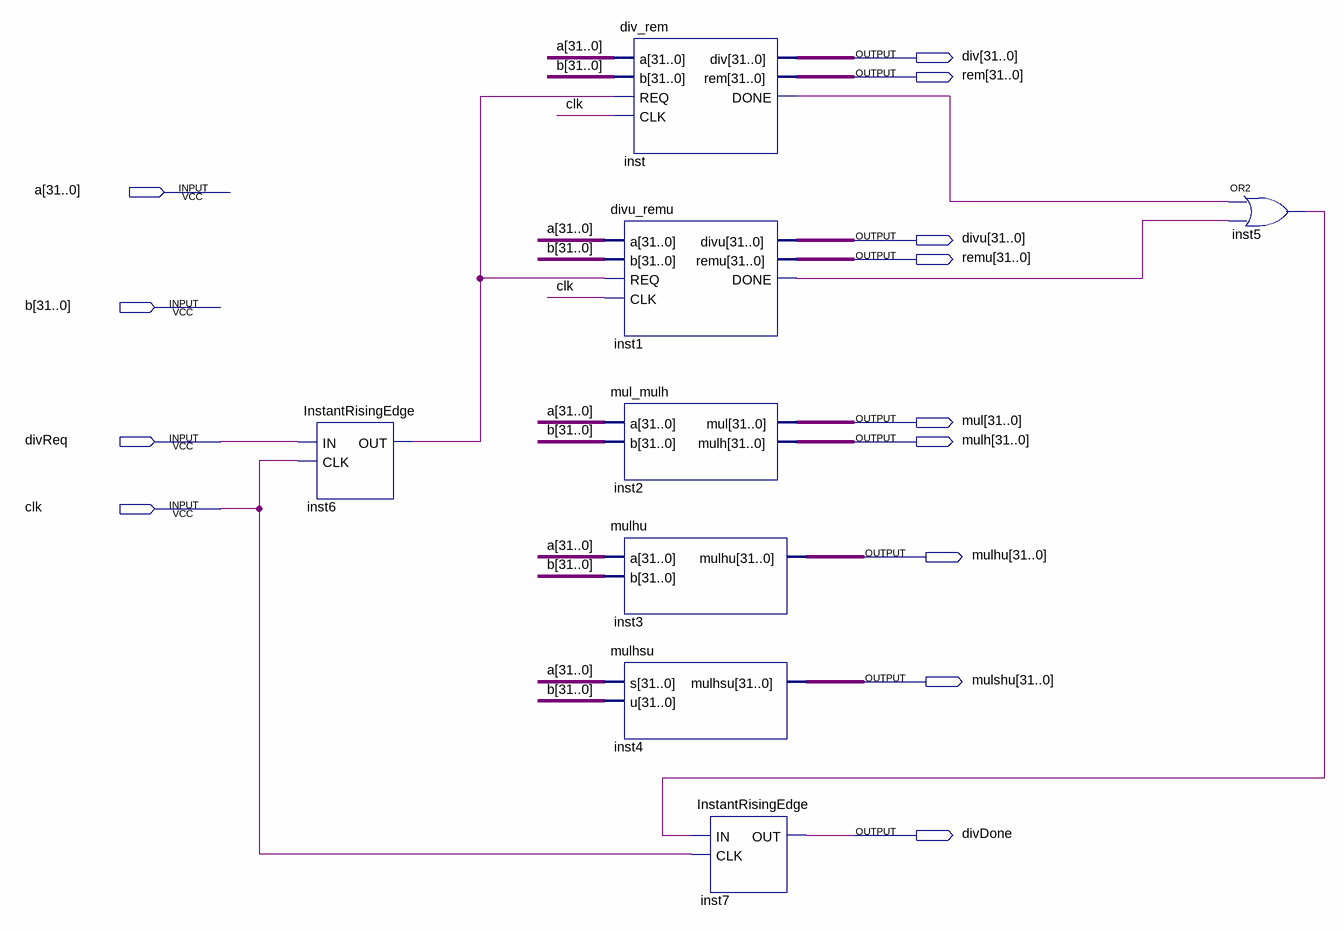
[diagram p0: schematic sheet]
// Quartus schematic mul.bdf as structural Verilog: 8 symbols, 13 pins
module mul (
  input  [31:0] a,
  input  [31:0] b,
  input  divReq,
  input  clk,
  output [31:0] div,
  output [31:0] rem,
  output [31:0] divu,
  output [31:0] remu,
  output [31:0] mul,
  output [31:0] mulh,
  output [31:0] mulhu,
  output [31:0] mulshu,
  output divDone
);

  wire inst1_done, inst5_out, inst6_out, inst_done;

  InstantRisingEdge inst6 (.IN(divReq), .CLK(clk), .OUT(inst6_out));
  div_rem inst (.a(a), .b(b), .REQ(inst6_out), .CLK(clk), .div(div), .rem(rem), .DONE(inst_done));
  divu_remu inst1 (.a(a), .b(b), .REQ(inst6_out), .CLK(clk), .divu(divu), .remu(remu), .DONE(inst1_done));
  mul_mulh inst2 (.a(a), .b(b), .mul(mul), .mulh(mulh));
  mulhu inst3 (.a(a), .b(b), .mulhu(mulhu));
  mulhsu inst4 (.s(a), .u(b), .mulhsu(mulshu));
  InstantRisingEdge inst7 (.IN(inst5_out), .CLK(clk), .OUT(divDone));
  or inst5 (inst5_out, inst_done, inst1_done);
endmodule
